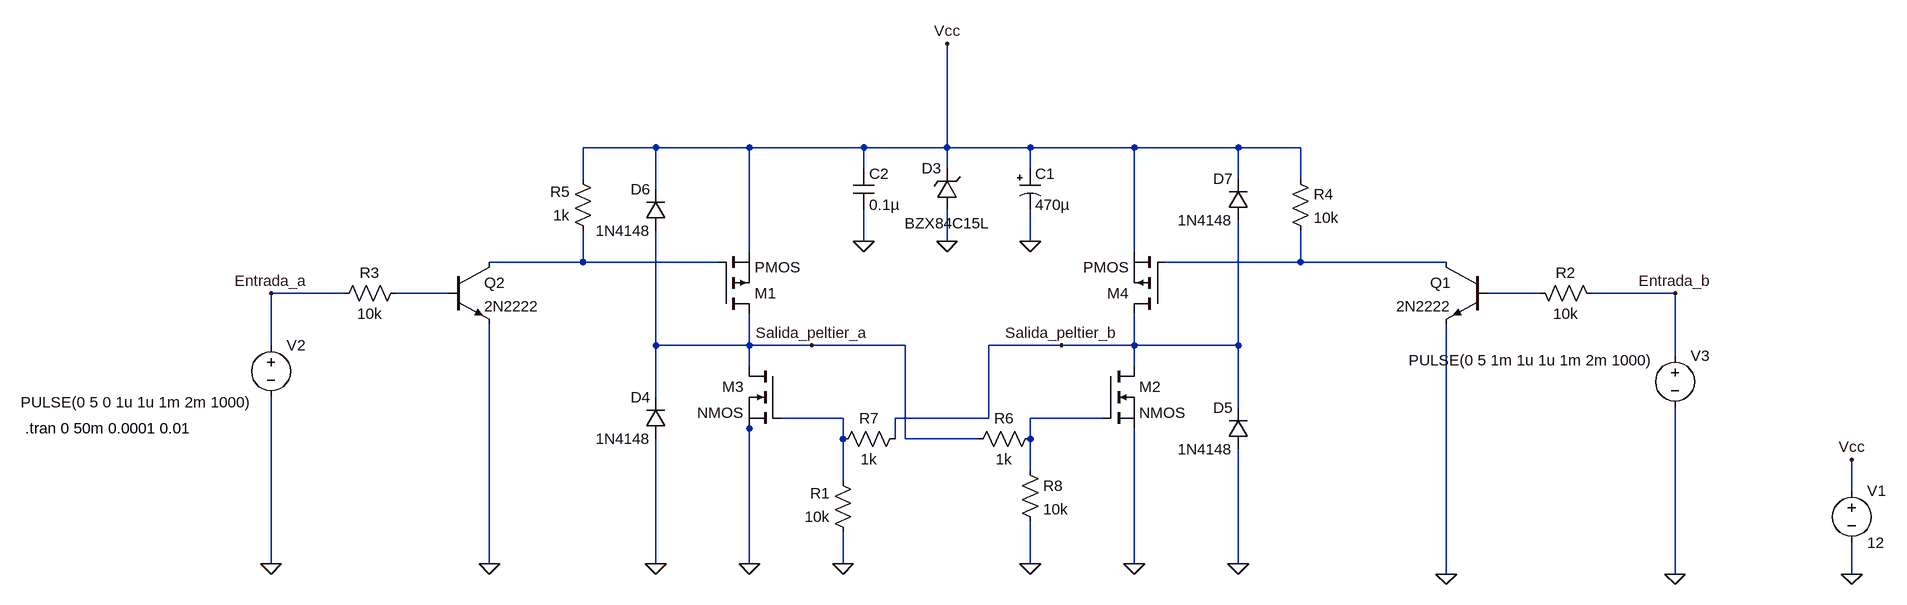
[diagram p0: schematic Olimpiadas2022_LTs.asc]
Olimpiadas2022_LTs.asc, the LTspice schematic file:
Version 4
SHEET 1 1772 912
WIRE -208 96 -320 96
WIRE -64 96 -208 96
WIRE 112 96 -64 96
WIRE 240 96 240 -64
WIRE 240 96 112 96
WIRE 368 96 240 96
WIRE 528 96 368 96
WIRE 688 96 528 96
WIRE 784 96 688 96
WIRE 112 128 112 96
WIRE 240 128 240 96
WIRE 368 128 368 96
WIRE -320 144 -320 96
WIRE 688 144 688 96
WIRE 784 144 784 96
WIRE -208 160 -208 96
WIRE 112 240 112 192
WIRE 240 240 240 192
WIRE 368 240 368 192
WIRE -64 256 -64 96
WIRE 528 256 528 96
WIRE -320 272 -320 224
WIRE -320 272 -464 272
WIRE -112 272 -320 272
WIRE 784 272 784 224
WIRE 784 272 576 272
WIRE 1008 272 784 272
WIRE -688 320 -800 320
WIRE -528 320 -608 320
WIRE 1152 320 1072 320
WIRE 1360 320 1232 320
WIRE -800 400 -800 320
WIRE -208 400 -208 224
WIRE -64 400 -64 352
WIRE -64 400 -208 400
WIRE 32 400 -64 400
WIRE 176 400 32 400
WIRE 416 400 304 400
WIRE 528 400 528 352
WIRE 528 400 416 400
WIRE 688 400 688 208
WIRE 688 400 528 400
WIRE 1360 416 1360 320
WIRE -64 432 -64 400
WIRE 528 432 528 400
WIRE -208 480 -208 400
WIRE 688 496 688 400
WIRE 80 512 -16 512
WIRE 304 512 304 400
WIRE 304 512 160 512
WIRE 480 512 368 512
WIRE -64 528 -64 512
WIRE 80 544 80 512
WIRE 160 544 160 512
WIRE 176 544 176 400
WIRE 288 544 176 544
WIRE 368 544 368 512
WIRE 368 592 368 544
WIRE 80 608 80 544
WIRE 1632 624 1632 576
WIRE -800 736 -800 480
WIRE -464 736 -464 368
WIRE -208 736 -208 544
WIRE -64 736 -64 528
WIRE 80 736 80 688
WIRE 368 736 368 672
WIRE 528 736 528 528
WIRE 688 736 688 560
WIRE 1008 752 1008 368
WIRE 1360 752 1360 496
WIRE 1632 752 1632 704
FLAG -64 736 0
FLAG 528 736 0
FLAG 80 736 0
FLAG 368 736 0
FLAG 112 240 0
FLAG 240 240 0
FLAG 368 240 0
FLAG 688 736 0
FLAG -208 736 0
FLAG -464 736 0
FLAG 1008 752 0
FLAG 32 400 Salida_peltier_a
FLAG 416 400 Salida_peltier_b
FLAG 240 -64 Vcc
FLAG 1632 576 Vcc
FLAG 1632 752 0
FLAG 1360 752 0
FLAG -800 736 0
FLAG -800 320 Entrada_a
FLAG 1360 320 Entrada_b
SYMBOL nmos 480 432 R0
SYMATTR InstName M2
SYMBOL pmos -112 352 M180
SYMATTR InstName M1
SYMBOL nmos -16 432 M0
SYMATTR InstName M3
SYMBOL pmos 576 352 R180
SYMATTR InstName M4
SYMBOL res 96 704 R180
WINDOW 0 36 76 Left 2
WINDOW 3 36 40 Left 2
SYMATTR InstName R1
SYMATTR Value 10k
SYMBOL res 1136 304 M90
WINDOW 0 0 56 VBottom 2
WINDOW 3 32 56 VTop 2
SYMATTR InstName R2
SYMATTR Value 10k
SYMBOL res -592 304 R90
WINDOW 0 0 56 VBottom 2
WINDOW 3 32 56 VTop 2
SYMATTR InstName R3
SYMATTR Value 10k
SYMBOL res 768 128 R0
SYMATTR InstName R4
SYMATTR Value 10k
SYMBOL res -304 240 R180
WINDOW 0 36 76 Left 2
WINDOW 3 36 40 Left 2
SYMATTR InstName R5
SYMATTR Value 1k
SYMBOL res 384 528 R90
WINDOW 0 0 56 VBottom 2
WINDOW 3 32 56 VTop 2
SYMATTR InstName R6
SYMATTR Value 1k
SYMBOL res 176 528 R90
WINDOW 0 0 56 VBottom 2
WINDOW 3 32 56 VTop 2
SYMATTR InstName R7
SYMATTR Value 1k
SYMBOL res 352 576 R0
SYMATTR InstName R8
SYMATTR Value 10k
SYMBOL zener 256 192 R180
WINDOW 0 24 64 Left 2
WINDOW 3 -50 -20 Left 2
SYMATTR InstName D3
SYMATTR Value BZX84C15L
SYMBOL polcap 352 128 R0
WINDOW 3 24 56 Left 2
SYMATTR InstName C1
SYMATTR Value 470µ
SYMATTR Description Capacitor
SYMATTR Type cap
SYMATTR SpiceLine V=2 Irms=7.07107 Rser=0.005 Lser=0 mfg="KEMET" pn="A700D477M002ATE005" type="Al electrolytic"
SYMBOL npn 1072 272 M0
SYMATTR InstName Q1
SYMATTR Value 2N2222
SYMBOL npn -528 272 R0
SYMATTR InstName Q2
SYMATTR Value 2N2222
SYMBOL diode -192 544 R180
WINDOW 0 24 64 Left 2
WINDOW 3 24 0 Left 2
SYMATTR InstName D4
SYMATTR Value 1N4148
SYMBOL diode 704 560 R180
WINDOW 0 24 64 Left 2
WINDOW 3 24 0 Left 2
SYMATTR InstName D5
SYMATTR Value 1N4148
SYMBOL cap 96 128 R0
SYMATTR InstName C2
SYMATTR Value 0.1µ
SYMBOL diode -192 224 R180
WINDOW 0 24 64 Left 2
WINDOW 3 24 0 Left 2
SYMATTR InstName D6
SYMATTR Value 1N4148
SYMBOL diode 704 208 R180
WINDOW 0 24 64 Left 2
WINDOW 3 24 0 Left 2
SYMATTR InstName D7
SYMATTR Value 1N4148
SYMBOL voltage 1632 608 R0
WINDOW 123 0 0 Left 0
WINDOW 39 0 0 Left 0
SYMATTR InstName V1
SYMATTR Value 12
SYMBOL voltage -800 384 R0
WINDOW 3 -385 104 Left 2
WINDOW 123 0 0 Left 0
WINDOW 39 0 0 Left 0
SYMATTR InstName V2
SYMATTR Value PULSE(0 5 0 1u 1u 1m 2m 1000)
SYMBOL voltage 1360 400 R0
WINDOW 3 -410 23 Left 2
WINDOW 123 0 0 Left 0
WINDOW 39 0 0 Left 0
SYMATTR InstName V3
SYMATTR Value PULSE(0 5 1m 1u 1u 1m 2m 1000)
TEXT -1178 528 Left 2 !.tran 0 50m 0.0001 0.01

The netlist it stands for:
* Olimpiadas2022_LTs.asc
M2 Salida_peltier_b N006 0 0 NMOS
M1 Salida_peltier_a N001 Vcc Vcc PMOS
M3 Salida_peltier_a N005 0 0 NMOS
M4 Salida_peltier_b N002 Vcc Vcc PMOS
R1 0 N005 10k
R2 N004 Entrada_b 10k
R3 N003 Entrada_a 10k
R4 Vcc N002 10k
R5 N001 Vcc 1k
R6 N006 Salida_peltier_a 1k
R7 Salida_peltier_b N005 1k
R8 N006 0 10k
D3 0 Vcc BZX84C15L
C1 Vcc 0 470µ V=2 Irms=7.07107 Rser=0.005 Lser=0 mfg="KEMET" pn="A700D477M002ATE005" type="Al electrolytic"
Q1 N002 N004 0 0 2N2222
Q2 N001 N003 0 0 2N2222
D4 0 Salida_peltier_a 1N4148
D5 0 Salida_peltier_b 1N4148
C2 Vcc 0 0.1µ
D6 Salida_peltier_a Vcc 1N4148
D7 Salida_peltier_b Vcc 1N4148
V1 Vcc 0 12
V2 Entrada_a 0 PULSE(0 5 0 1u 1u 1m 2m 1000)
V3 Entrada_b 0 PULSE(0 5 1m 1u 1u 1m 2m 1000)
.model D D
.lib standard.dio
.model NPN NPN
.model PNP PNP
.lib standard.bjt
.model NMOS NMOS
.model PMOS PMOS
.lib standard.mos
.tran 0 50m 0.0001 0.01
.backanno
.end